# EAGLE design LightingUPS-AC (EAGLE 7.6.0)
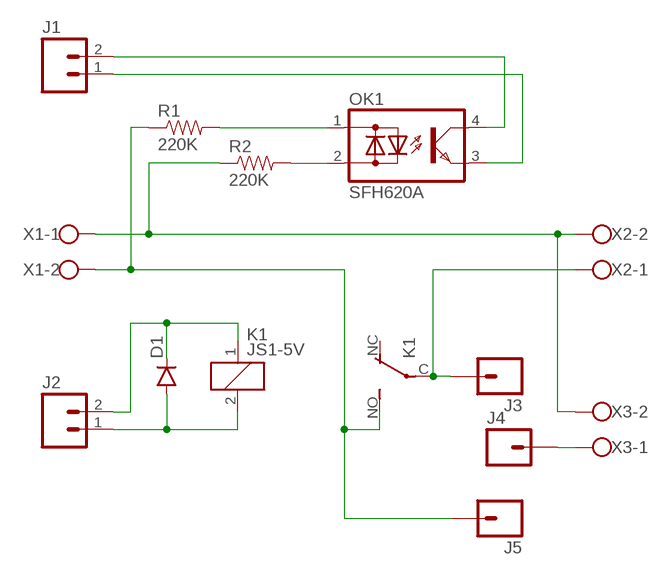
[diagram p0: schematic, sheet 1]

## Parts
D1  DIODEPTH  [DIODE-1N4001]
J1  M02PTH  [1X02]
J2  M02PTH  [1X02]
J3  M01PTH  [1X01]
J4  M01PTH  [1X01]
J5  M01PTH  [1X01]
K1  JS1-5V  JS-M1-9V-4  [JS-M]
OK1  SFH620A  [DIL04]
R1  220K  RESISTORPTH-1/4W  [AXIAL-0.4]
R2  220K  RESISTORPTH-1/4W  [AXIAL-0.4]
X1  W237-102  [W237-102]
X2  W237-102  [W237-102]
X3  W237-102  [W237-102]

## Nets
N$1: J4.1 X3.1
N$2: J1.1 OK1.3(E)
N$3: J3.1 K1.C(2:P) X2.1
N$4: D1.A J2.1 K1.2
N$5: D1.C J2.2 K1.1
N$6: J1.2 OK1.4(C)
N$8: OK1.2(AC2) R2.P$2
N$9: OK1.1(AC1) R1.P$2
N$11: R2.P$1 X1.1 X2.2 X3.2
N$12: J5.1 K1.NO(2:S) R1.P$1 X1.2
Unconnected: K1.NC(2:O)

## Library data of the parts
D1 = SparkFun-DiscreteSemi:DIODE: Diode These are standard reverse protection diodes and small signal diodes. SMA package can handle up to about 1A. SOD-323 can handle about 200mA. What the SOD-323 package when ordering, there are some mfgs out there that are 5-pin packages.
J1 J2 = SparkFun-Connectors:M02: Standard 2-pin 0.1" header. Use with - straight break away headers ( PRT-00116) - right angle break away headers (PRT-00553) - swiss pins (PRT-00743) - machine pins (PRT-00117) - female headers (PRT-00115) Molex polarized connector foot print use with: PRT-08233 with associated crimp pins and housings. 2.54_SCREWTERM for use with PRT-10571. 3.5mm Screw Terminal footprints for PRT-08084 5mm Screw Terminal footprints for use with PRT-08432
J3-J5 = SparkFun-Connectors:M01: Header 1 Standard 1-pin 0.1" header. Use with straight break away headers (SKU : PRT-00116), right angle break away headers (PRT-00553), swiss pins (PRT-00743), machine pins (PRT-00117), and female headers (PRT-00115). SMTSO-256-ET is a "flush mount" nut for a 4-40 screw. The older package used to be too tight, and did not allow it to sit properly thru the drill hit. The latest (0.165DIA) fits nice and snug.
K1 = relay:JS-M1*: Automotive Ultra-Miniature Power Relay NAiS Source: http://www.mew-europe.com/.. en_ds_61211_0000.pdf; OC_FARNELL: unknown; OC_NEWARK: unknown
OK1 = optocoupler:SFH620: Optocoupler, Phototransistor Output, AC Input Source: http://www.vishay.com/docs/83675/sfh620.pdf; MPN: SFH620A-2; OC_FARNELL: 1469594; OC_NEWARK: 97K9546
R1 R2 = SparkFun-Passives:RESISTOR: Resistor Basic schematic elements and footprints for 0603, 1206, and PTH resistors.
X1-X3 = con-wago-500:W237-102: WAGO SCREW CLAMP; MPN: 237-102; OC_FARNELL: unknown; OC_NEWARK: 70K9898

## Board
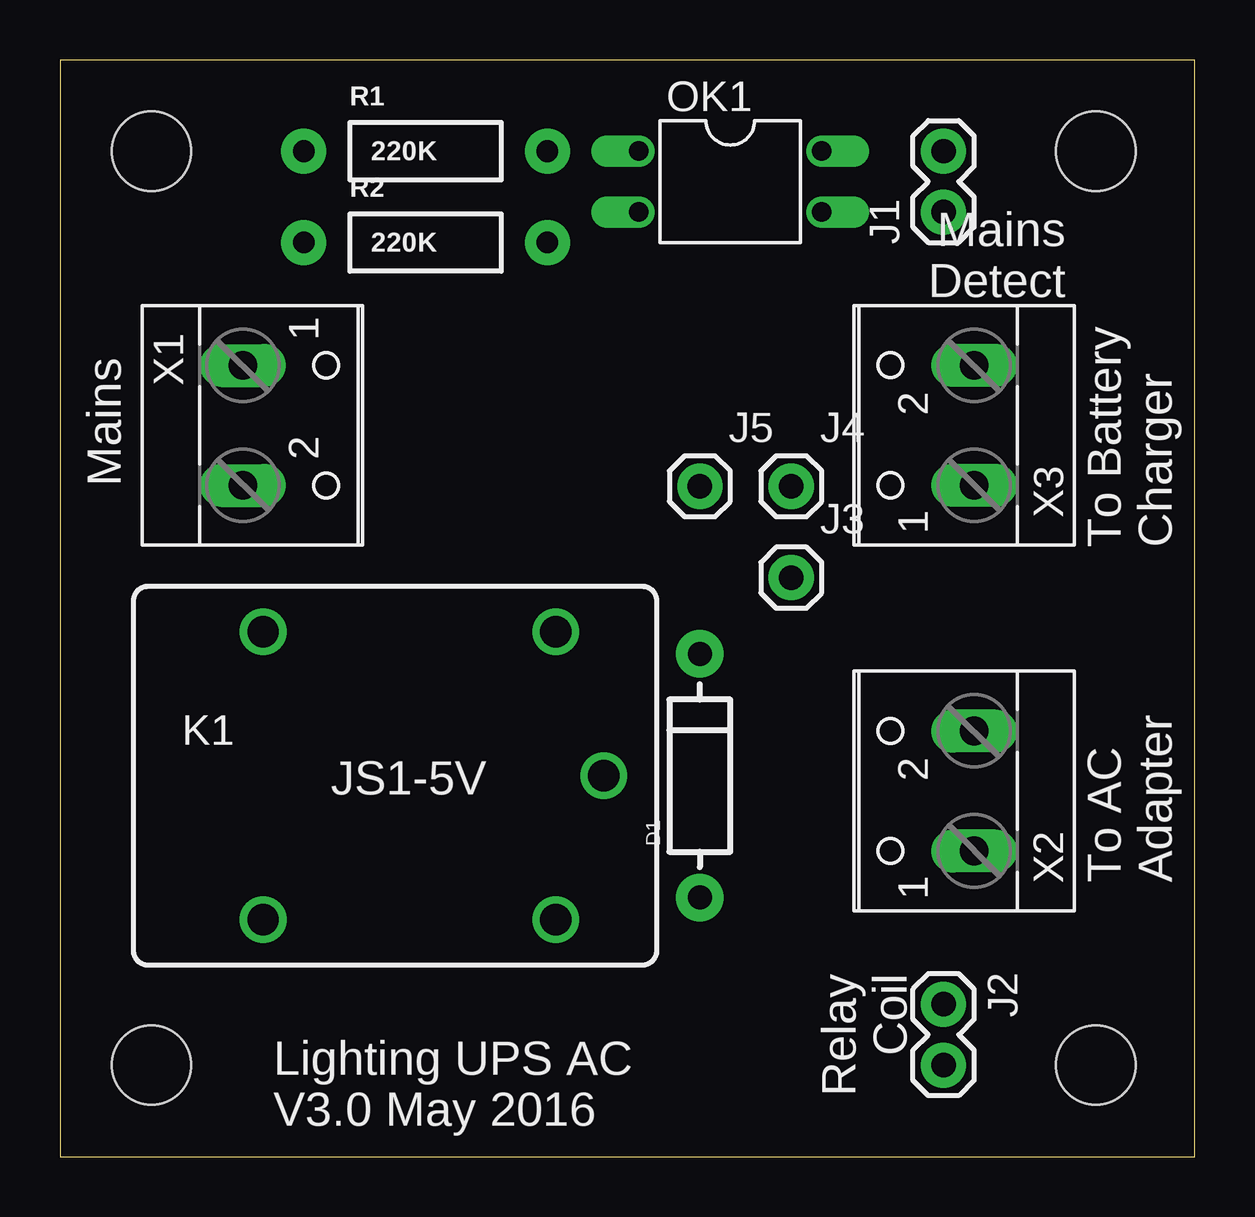
[diagram p1: board, top side]
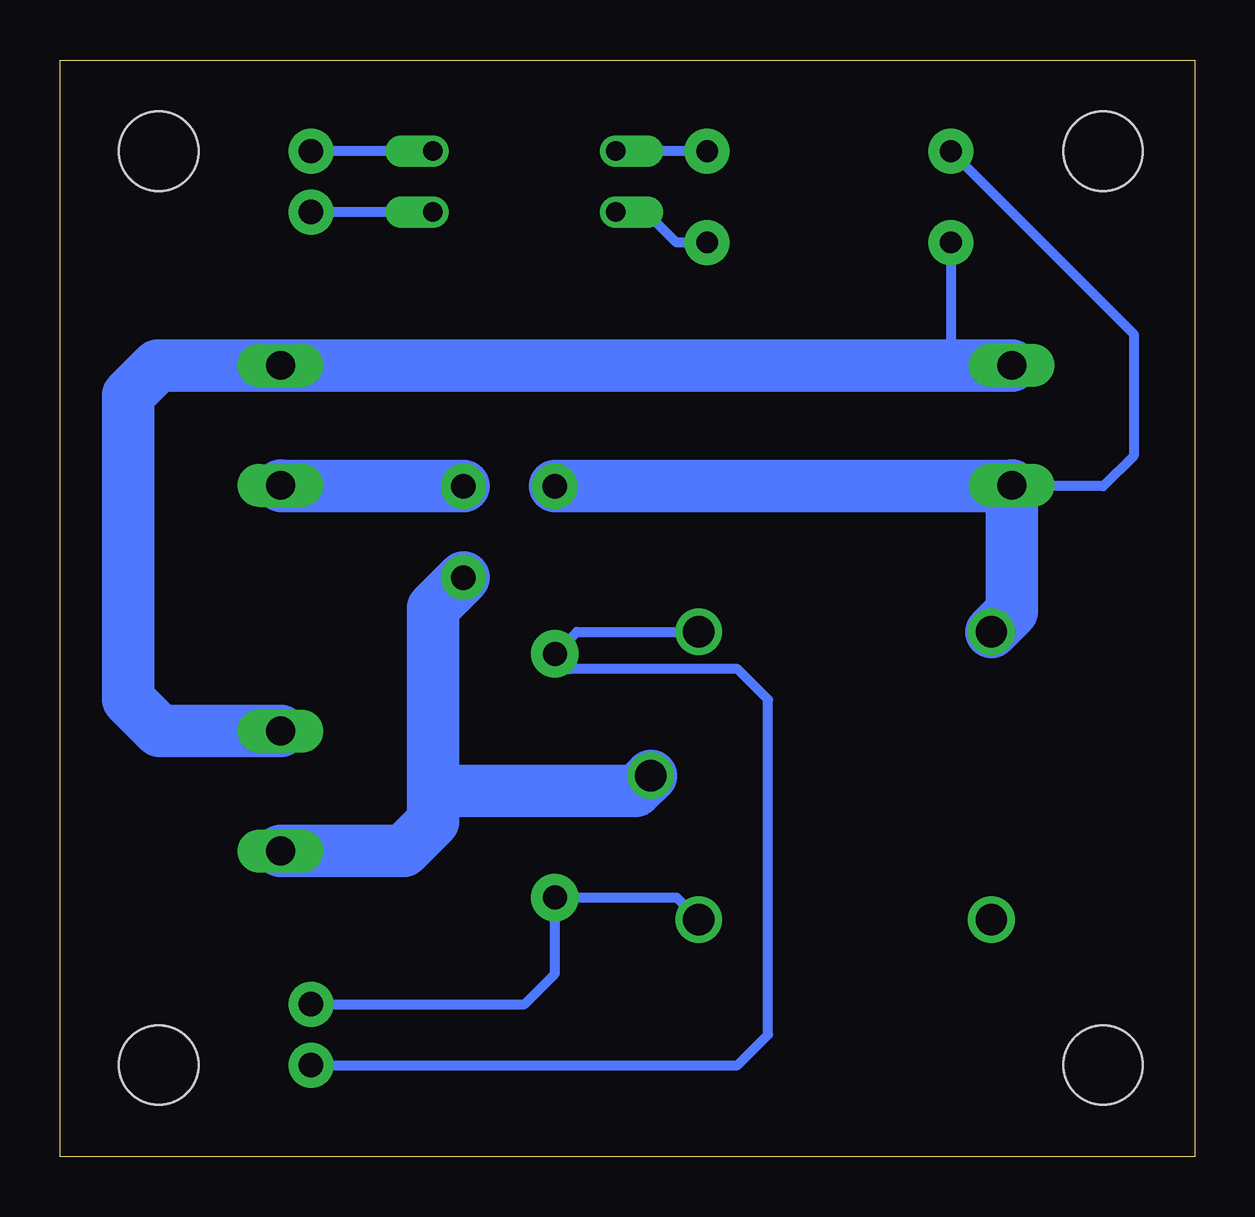
[diagram p2: board, bottom side, seen from below]

Size 47.3 x 45.71 mm. Coordinates in mm from the lower left corner, seen from the top.
Outline: 0,0 47.3,0 47.3,45.71 0,45.71 0,0
Copper layers (1*16): Top 0.035mm / dielectric 1.5mm / Bottom 0.035mm
Design rules "SeeedStudio_2layer_DRU_no_angle_20140221": minimum track width 6mil, minimum drill 12mil, track to track 6mil, track to pad 6mil, pad to pad 6mil, via to via 6mil, smd to smd 0mil, copper to edge 10mil, drill to drill 10mil, minimum pad ring 10mil, minimum via ring 6mil, stop-mask expansion 2mil, vias tented up to drill 100mil, thermal gap 10mil

### Footprints (pad centres in the part's own frame; a part is rotated, then mirrored left to right if it is on the bottom)
DIODE-1N4001 = drill 1 pad 1.981: A -5.08,0; C 5.08,0
1X02 = drill 1.016 pad 1.88: 1 0,0; 2 2.54,0
1X01 = drill 1.016 pad 1.88: 1 0,0
JS-M = drill 1.3: 1 6.7,6; 2 6.7,-6; C 8.7,0; NC -5.5,-6; NO -5.5,6
DIL04 = drill 0.813 offset: 1 -1.27,-3.81; 2 1.27,-3.81; 3 1.27,3.81; 4 -1.27,3.81
AXIAL-0.4 = drill 0.9 pad 1.88: P$1 -5.08,0; P$2 5.08,0
STAND-OFF = hole 3.302: 0,0
W237-102 = drill 1.194 long: 1 -2.5,-1.27; 2 2.5,-1.27

### Placement (x,y rotation side)
D1  26.67,15.88 90 top
J1  36.83,39.37 90 top
J2  36.83,6.35 270 top
J3  30.48,24.13 0 top
J4  30.48,27.94 0 top
J5  26.67,27.94 0 top
K1  13.97,15.88 0 top
OK1  27.94,40.64 270 top
R1  15.24,41.91 0 top
R2  15.24,38.1 0 top
U$1  [STAND-OFF]  3.81,41.91 0 top
U$2  [STAND-OFF]  3.81,3.81 0 top
U$3  [STAND-OFF]  43.18,41.91 0 top
U$4  [STAND-OFF]  43.18,3.81 0 top
X1  8.89,30.48 270 top
X2  36.83,15.24 90 top
X3  36.83,30.48 90 top

### Tracks (layer width: path | path; a pad name or v marks a point on that pad's centre or on a via)
N$1
  Bottom 2.184: J4.1 38.06,27.94 X3.1
N$2
  Bottom 0.406: OK1.3 J1.1
N$3
  Bottom 2.184: J3.1 31.75,22.86 31.75,15.24 | 31.75,15.24 31.75,13.97 32.98,12.74 X2.1 | K1.C 23.3,15.24 31.75,15.24
N$4
  Bottom 0.406: J2.1 27.94,6.35 26.67,7.62 D1.A 21.59,10.79 K1.2
N$5
  Bottom 0.406: J2.2 19.05,3.81 17.78,5.08 17.78,19.05 19.05,20.32 26.04,20.32 D1.C 25.75,21.88 K1.1
N$6
  Bottom 0.406: OK1.4 J1.2
N$8
  Bottom 0.406: R2.P$2 21.59,38.1 22.86,39.37 OK1.2
N$9
  Bottom 0.406: R1.P$2 OK1.1
N$11
  Bottom 0.406: R2.P$1 10.16,32.98
  Bottom 2.184: X1.1 10.16,32.98 X3.2 43.22,32.98 44.45,31.75 44.45,19.05 43.14,17.74 X2.2
N$12
  Bottom 0.406: R1.P$1 2.54,34.29 2.54,29.21 3.81,27.94 7.58,27.94 X1.2
  Bottom 2.184: K1.NO 7.62,22.73 X1.2 7.66,27.94 J5.1

### Text on the board
tPlace: Mains / Detect | Mains | To Battery / Charger | JS1-5V | To AC / Adapter | Relay / Coil | Lighting UPS AC / V3.0 May 2016